# Altium schematic sheet 4.LC PRI.SchDoc: 6.6kW Daul OBC +11kW WPT
size A3; Date: 19/12/16; Revision: V 1.0; SheetNumber: 4; SheetTotal: 14; PageSetup: Record=PageOptions|CenterHorizontal=True|CenterVertical=True|PrintScale=0.71|XCorrection=1.00|YCorrection=1.00|PrintKind=2|BorderSize=5000000|LeftOffset=0|BottomOffset=0|Orientation=2|PaperLength=1000|PaperWidth=1000|Scale=100|PaperSource=7|PrintQuality=-4|MediaType=1|DitherType=10|PaperKind=A4|PrintScaleMode=1; ImagePath: 0
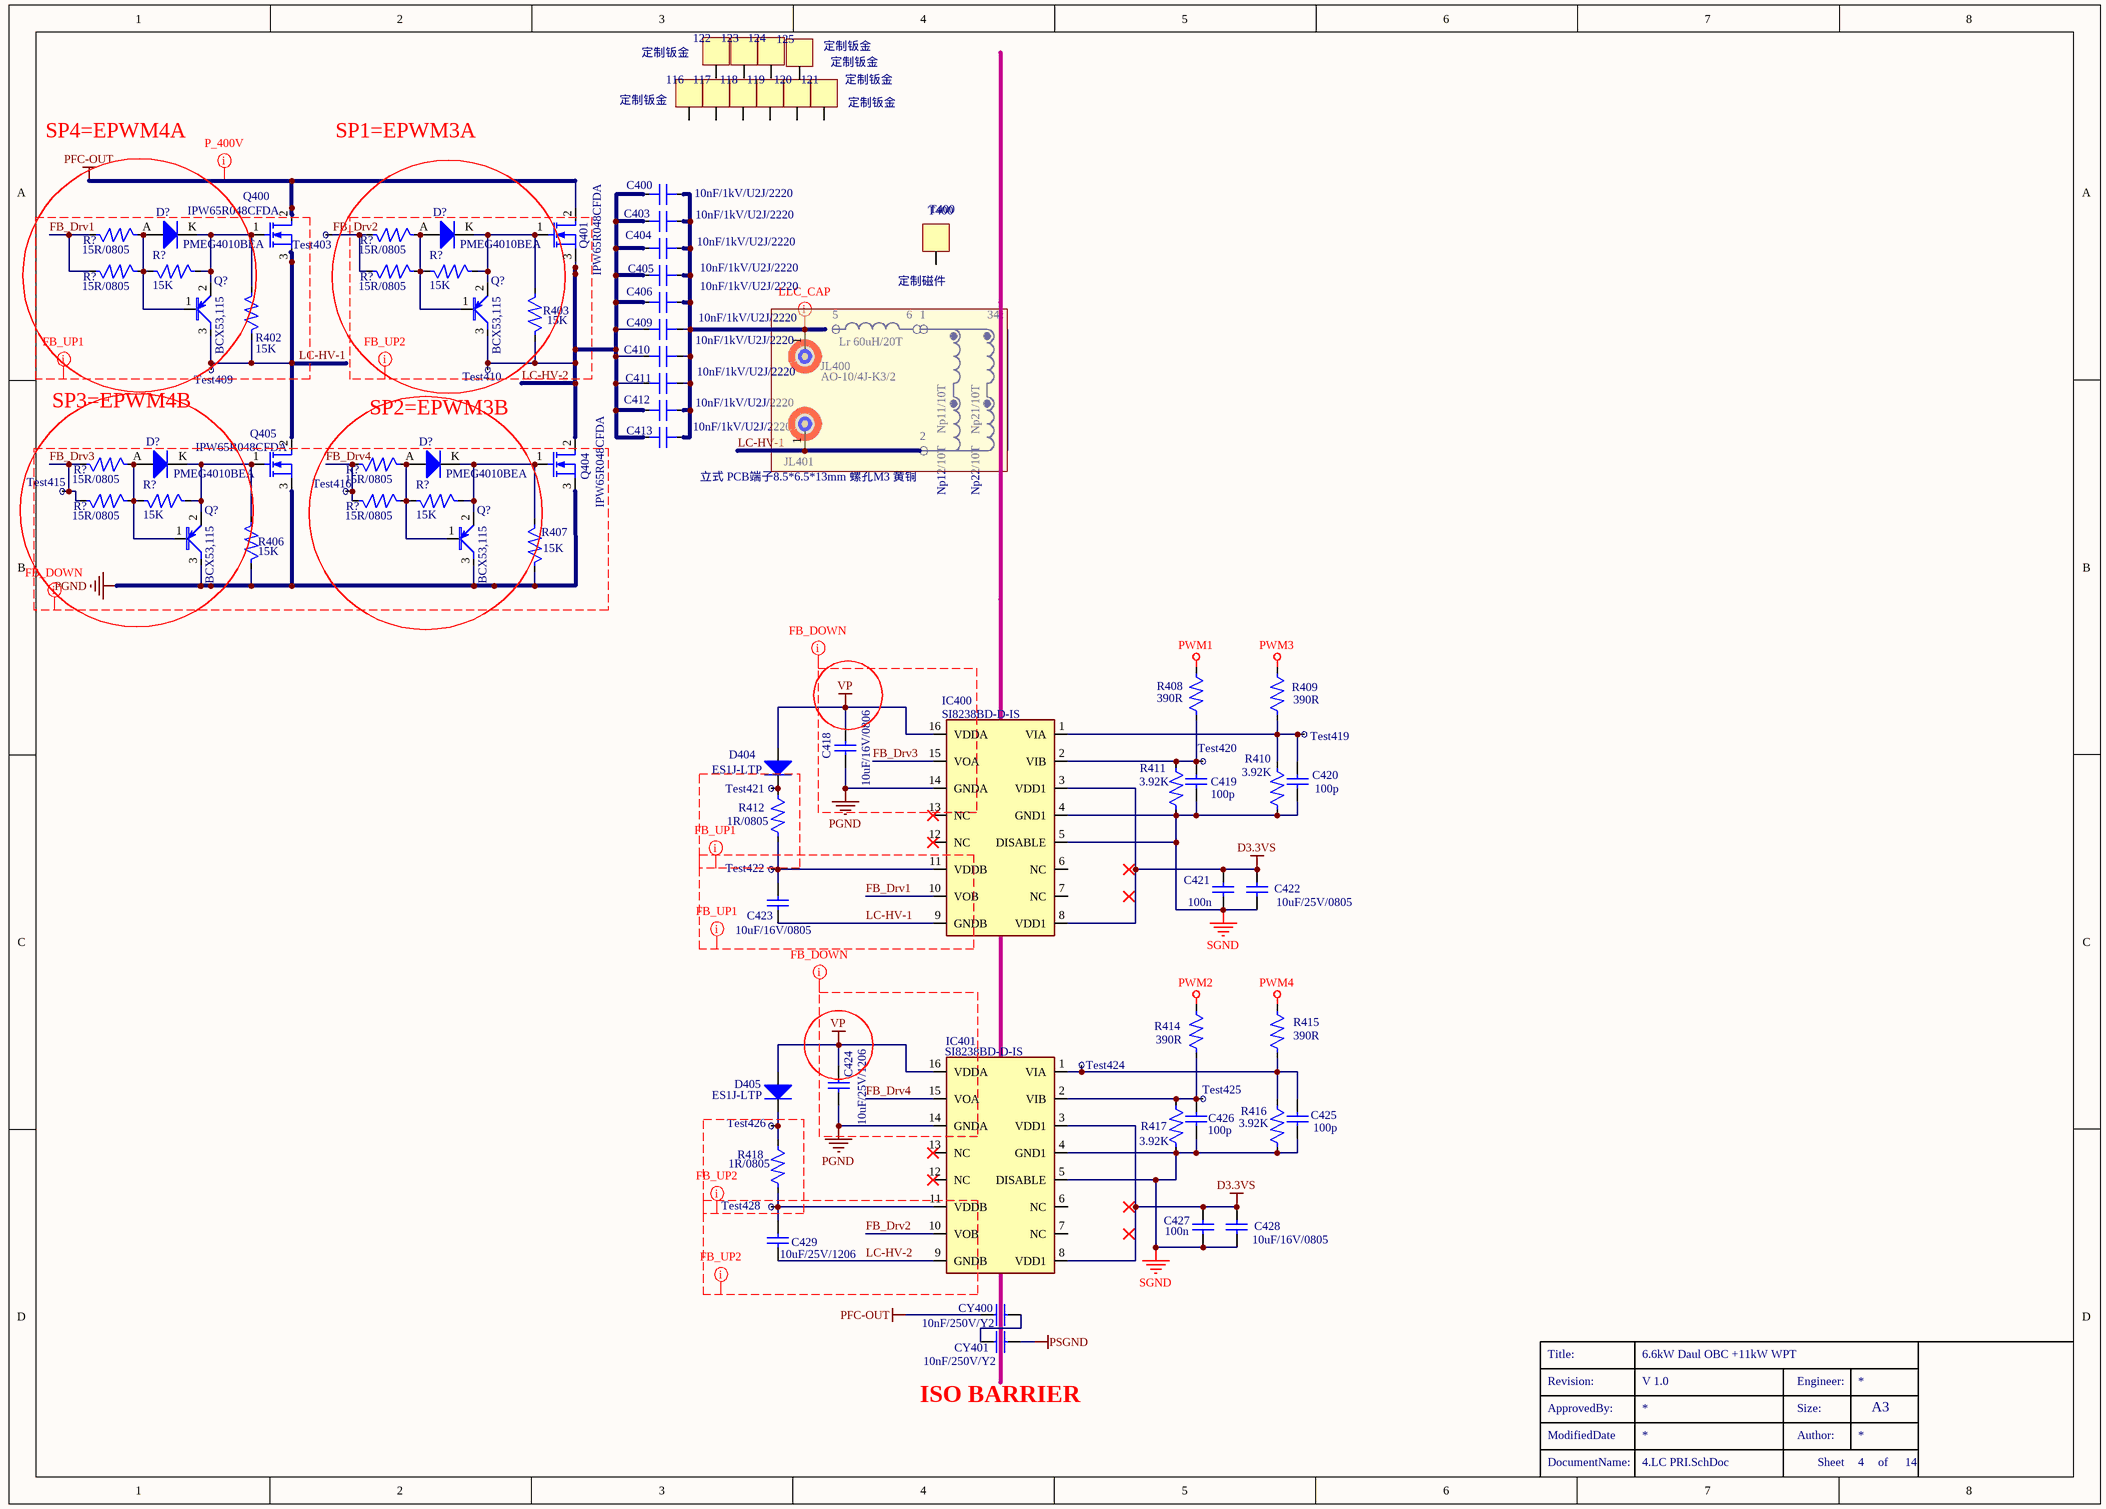
[diagram p0: 4.LC PRI.SchDoc]

## Parts
(Parts that share a designator on the sheet are numbered #1, #2 ... from top to bottom, then left to right.)
116  定制钣金  [jump-1.57*3.14*1]
117  定制钣金  [jump-1.57*3.14*1]
118  定制钣金  [jump-1.57*3.14*1]
119  定制钣金  [jump-1.57*3.14*1]
120  定制钣金  [jump-1.57*3.14*1]
121  定制钣金  [jump-1.57*3.14*1]
122  定制钣金  [jump-1.57*3.14*1]
123  定制钣金  [jump-1.57*3.14*1]
124  定制钣金  [jump-1.57*3.14*1]
125  定制钣金  [jump-1.57*3.14*1]
C400  10nF/1kV/U2J/2220  [c2220]
C403  10nF/1kV/U2J/2220  [c2220]
C404  10nF/1kV/U2J/2220  [c2220]
C405  10nF/1kV/U2J/2220  [c2220]
C406  10nF/1kV/U2J/2220  [c2220]
C409  10nF/1kV/U2J/2220  [c2220]
C410  10nF/1kV/U2J/2220  [c2220]
C411  10nF/1kV/U2J/2220  [c2220]
C412  10nF/1kV/U2J/2220  [c2220]
C413  10nF/1kV/U2J/2220  [c2220]
C418  10uF/16V/0806  [c0805]
C419  100p  [C0402]
C420  100p  [C0402]
C421  100n  [C0402]
C422  10uF/25V/0805  [C0805]
C423  10uF/16V/0805  [c0805]
C424  10uF/25V/1206  [C1206]
C425  100p  [C0402]
C426  100p  [C0402]
C427  100n  [C0402]
C428  10uF/16V/0805  [C0805]
C429  10uF/25V/1206  [C1206]
CY400  10nF/250V/Y2  [C_DISK_7.5- D14]
CY401  10nF/250V/Y2  [C_DISK_7.5- D14]
D404  ES1J-LTP  [DO-214AC]
D405  ES1J-LTP  [DO-214AC]
D?#1  PMEG4010BEA  [D_SOD323]
D?#2  PMEG4010BEA  [D_SOD323]
D?#3  PMEG4010BEA  [D_SOD323]
D?#4  PMEG4010BEA  [D_SOD323]
IC400  SI8238BD‐D‐IS  [SOIC_W_16]
IC401  SI8238BD‐D‐IS  [SOIC_W_16]
JL400  AO-10/4J-K3/2  [CON_4-7*5]
JL401  立式 PCB端子8.5*6.5*13mm 螺孔M3 黄铜  [CON_4]
Q400  IPW65R048CFDA  [Q_TO-247_TH _1]
Q401  IPW65R048CFDA  [Q_TO-247_TH _1]
Q404  IPW65R048CFDA  [Q_TO-247_TH _1]
Q405  IPW65R048CFDA  [Q_TO-247_TH _1]
Q?#1  BCX53,115  [SOT89_MCP1703]
Q?#2  BCX53,115  [SOT89_MCP1703]
Q?#3  BCX53,115  [SOT89_MCP1703]
Q?#4  BCX53,115  [SOT89_MCP1703]
R402  15K  [R0402]
R403  15K  [R0402]
R406  15K  [R0402]
R407  15K  [R0402]
R408  390R  [R0402]
R409  390R  [R0402]
R410  3.92K  [R0402]
R411  3.92K  [R0402]
R412  1R/0805  [R0805]
R414  390R  [R0402]
R415  390R  [R0402]
R416  3.92K  [R0402]
R417  3.92K  [R0402]
R418  1R/0805  [r0805]
R?#1  15R/0805  [R0805]
R?#2  15R/0805  [R0805]
R?#3  15R/0805  [R0805]
R?#4  15K  [R0402]
R?#5  15R/0805  [R0805]
R?#6  15K  [R0402]
R?#7  15R/0805  [R0805]
R?#8  15R/0805  [R0805]
R?#9  15R/0805  [R0805]
R?#10  15K  [R0402]
R?#11  15R/0805  [R0805]
R?#12  15K  [R0402]
T400  定制磁件  [PQ5050+PQ5019 立式]
Test403  测试点  [测试点]  (value not drawn)
Test409  测试点  [测试点]  (value not drawn)
Test410  测试点  [测试点]  (value not drawn)
Test415  测试点  [测试点]  (value not drawn)
Test416  测试点  [测试点]  (value not drawn)
Test419  测试点  [测试点]  (value not drawn)
Test420  测试点  [测试点]  (value not drawn)
Test421  测试点  [测试点]  (value not drawn)
Test422  测试点  [测试点]  (value not drawn)
Test424  测试点  [测试点]  (value not drawn)
Test425  测试点  [测试点]  (value not drawn)
Test426  测试点  [测试点]  (value not drawn)
Test428  测试点  [测试点]  (value not drawn)

## Nets
D3.3VS: C421.2 C422.1 C427.2 C428.1 IC400.3(VDD1) IC400.8(VDD1) IC401.3(VDD1) IC401.8(VDD1)
PFC-OUT: CY400.1 Q400.2(D) Q401.2(D)
PGND: C418.1 C424.2 IC400.14(GNDA) IC401.14(GNDA) Q404.3(S) Q405.3(S) Q?#3.3(C) Q?#4.3(C) R406.1 R407.1
PSGND: CY401.2
PWM1: R408.1
PWM2: R414.1
PWM3: R409.1
PWM4: R415.1
SGND: C419.1 C420.1 C421.1 C422.2 C425.1 C426.1 C427.1 C428.2 IC400.4(GND1) IC400.5(DISABLE) IC401.4(GND1) IC401.5(DISABLE) R410.2 R411.2 R416.2 R417.2
VP: C418.2 C424.1 D404.A D405.A IC400.16(VDDA) IC401.16(VDDA)
FB_Drv1: IC400.10(VOB) R?#1.1 R?#3.1
FB_Drv2: IC401.10(VOB) R?#2.1 R?#5.1 Test403.1
FB_Drv3: IC400.15(VOA) R?#7.1 R?#9.1 Test415.1
FB_Drv4: IC401.15(VOA) R?#8.1 R?#11.1 Test416.1
LC-HV-1: C423.1 IC400.9(GNDB) JL401.1 Q400.3(S) Q405.2(D) Q?#1.3(C) R402.1 Test409.1
LC-HV-2: C400.2 C403.2 C404.2 C405.2 C406.2 C409.2 C410.2 C411.2 C412.2 C413.2 C429.2 IC401.9(GNDB) Q401.3(S) Q404.2(D) Q?#2.3(C) R403.1 Test410.1
NetC400_1: C400.1 C403.1 C404.1 C405.1 C406.1 C409.1 C410.1 C411.1 C412.1 C413.1 JL400.1
NetC419_2: C419.2 IC400.2(VIB) R408.2 R411.1 Test420.1
NetC420_2: C420.2 IC400.1(VIA) R409.2 R410.1 Test419.1
NetC423_2: C423.2 IC400.11(VDDB) R412.2 Test422.1
NetC425_2: C425.2 IC401.1(VIA) R415.2 R416.1 Test424.1
NetC426_2: C426.2 IC401.2(VIB) R414.2 R417.1 Test425.1
NetC429_1: C429.1 IC401.11(VDDB) R418.2 Test428.1
NetCY400_2: CY400.2 CY401.1
NetD404_K: D404.K R412.1 Test421.1
NetD405_K: D405.K R418.1 Test426.1
NetD?#1_A: D?#1.A Q?#1.1(B) R?#1.2 R?#3.2 R?#4.2
NetD?#1_K: D?#1.K Q400.1(G) Q?#1.2(E) R402.2 R?#4.1
NetD?#2_A: D?#2.A Q?#2.1(B) R?#2.2 R?#5.2 R?#6.2
NetD?#2_K: D?#2.K Q401.1(G) Q?#2.2(E) R403.2 R?#6.1
NetD?#3_A: D?#3.A Q?#3.1(B) R?#7.2 R?#9.2 R?#10.2
NetD?#3_K: D?#3.K Q405.1(G) Q?#3.2(E) R406.2 R?#10.1
NetD?#4_A: D?#4.A Q?#4.1(B) R?#8.2 R?#11.2 R?#12.2
NetD?#4_K: D?#4.K Q404.1(G) Q?#4.2(E) R407.2 R?#12.1

Not connected (* = marked no-connect by the designer): 116 1; 117 1; 118 1; 119 1; 120 1; 121 1; 122 1; 123 1; 124 1; 125 1; IC400 6(NC) 7(NC) 12(NC)* 13(NC)*; IC401 6(NC) 7(NC) 12(NC)* 13(NC)*; T400 1

## Layout directives
net class P_400V: PFC-OUT
net class Primary; net class LLC_CAP: NetC400_1
net class FB_UP1: FB_Drv1, LC-HV-1
net class FB_UP2: (no net found under the mark), FB_Drv2, LC-HV-2
net class FB_DOWN: FB_Drv3, FB_Drv4, PGND, VP

## Notes on the sheet
- SP4=EPWM4A
- SP1=EPWM3A
- (near T400) T400
- (near JL400) 5
- 6
- 1
- 34
- :
- (near JL400) Lr 60uH/20T
- Np11/10T
- Np21/10T
- SP3=EPWM4B
- SP2=EPWM3B
- 2
- Np12/10T
- Np22/10T
- (near CY401) ISO BARRIER
- Revision:
- Title:
- Engineer:
- ModifiedDate
- ApprovedBy:
- Author:
- Size:
- A3
- DocumentName:
- Sheet
- of

## Library data of the parts
116-125 T400 = Connector 1: Revision: 17-Jul-2002: Re-released for DXP Platform.; Publisher: Altium Limited
C400 C403-C406 C409-C413 = CAPACITOR_ XCAP: U2J 10nF 1000V 5% 2220 muRata; DIP/SMD: SMD; Top/Bottom: Bottom; Revision: 1
C418 C423 = Cap: Capacitor; Published: 8-Jun-2000; LatestRevisionDate: 17-Jul-2002; LatestRevisionNote: Re-released for DXP Platform.; PackageReference: RAD-0.3; Publisher: Altium Limited; PackageDescription: Radial Cap, Thru-Hole; 2 Leads; 0.3 in Pin Spacing
C419-C422 C424-C429 = CAP
CY400 CY401 = Y-CAP: 2.2nF 20% Y2 250V Φ8 7.5mm muRata; OriginalName: CAPSEMI; ComponentField6: Published 8-Jun-2000; DIP/SMD: DIP; Top/Bottom: Top
D404 D405 = DIODE
D?#1-D?#4 = DIODE_BAT54J: 30V 200mA SOD523 NXP; DIP/SMD: SMD; Top/Bottom: Top
IC400 IC401 = ADuM4223/ADuM3223
JL400 JL401 = Teminal: DIP/SMD: DIP; Top/Bottom: Top
Q400 Q401 Q404 Q405 = MOSFET_N CHANNEL: N MOS FET; Parameter: 2N7002K-T1GE3
Q?#1-Q?#4 = PNP
R402 R403 R406-R412 R414-R418 R?#4 R?#6 R?#10 R?#12 = RESISTOR
R?#1-R?#3 R?#5 R?#7-R?#9 R?#11 = RESISTOR_0805: RESISTOR; DIP/SMD: SMD; Top/Bottom: Top; VALUE: 15R/0805; Part Number: *